# Altium schematic sheet RPI 3.SchDoc
size A4; SheetNumber: 1; SheetTotal: 1
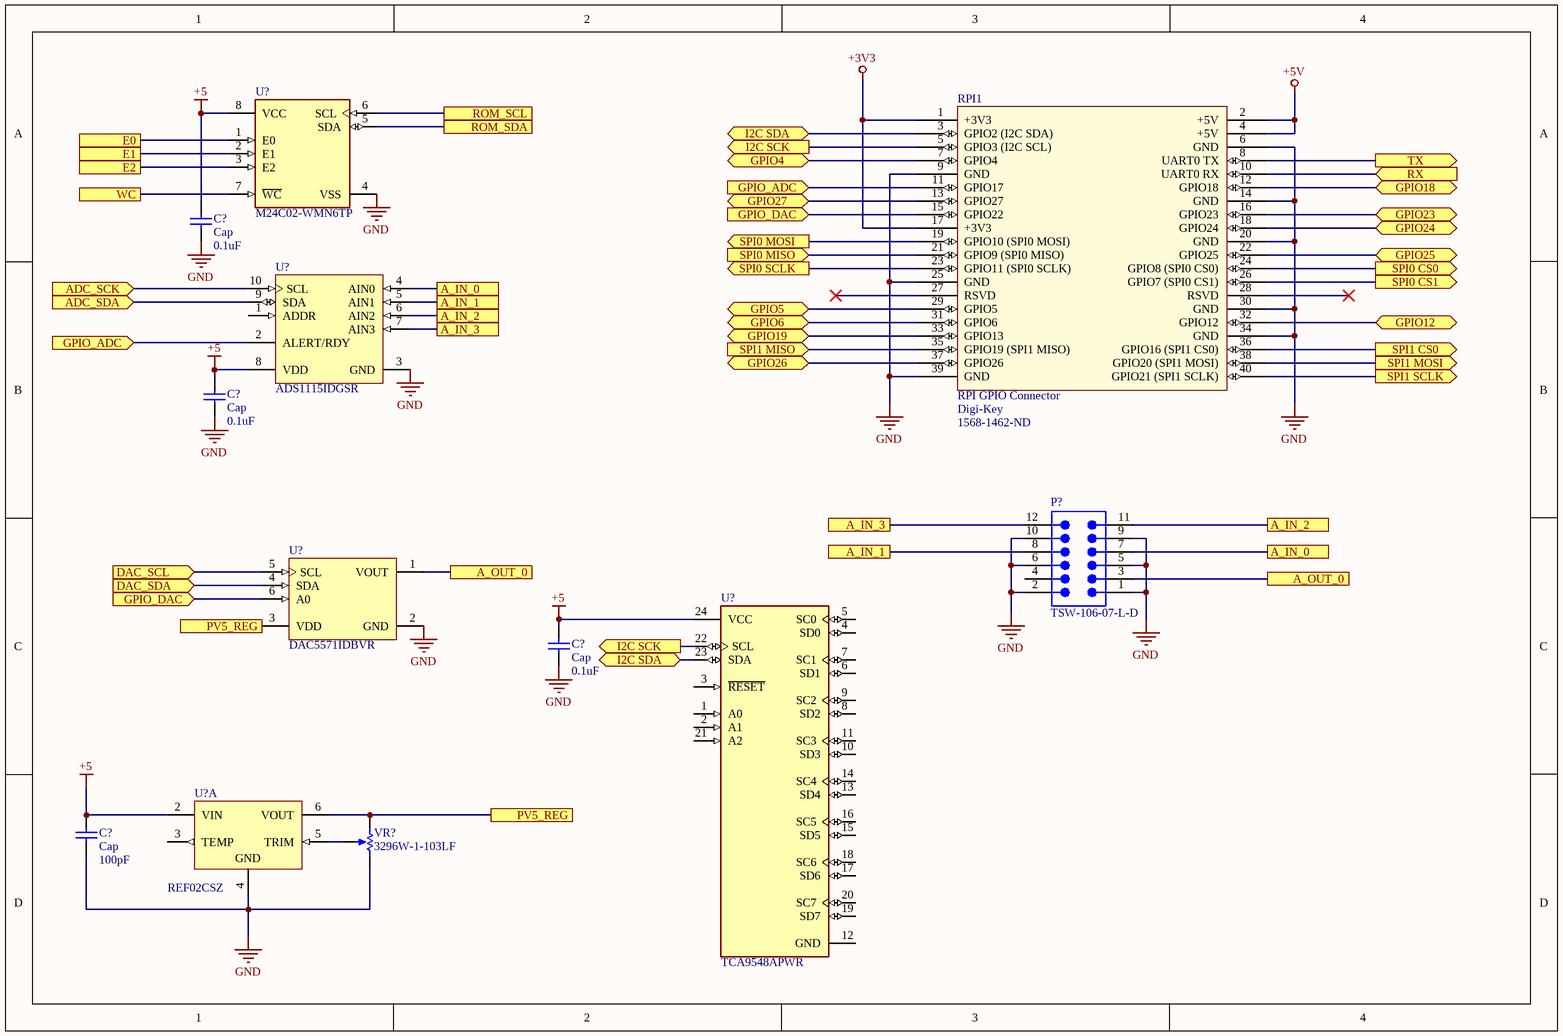
[diagram p0: RPI 3.SchDoc]

## Parts
(Parts that share a designator on the sheet are numbered #1, #2 ... from top to bottom, then left to right.)
C?#1  Cap  value 0.1uF  [RAD-0.3]
C?#2  Cap  value 0.1uF  [RAD-0.3]
C?#3  Cap  value 0.1uF  [RAD-0.3]
C?#4  Cap  value 100pF  [RAD-0.3]
P?  TSW-106-07-L-D  [SMTC-TSW-106-07-X-D]
RPI1  RPI GPIO Connector  Supplier 1: Digi-Key  Supplier Part Number 1: 1568-1462-ND  [rpi]
U?#1  M24C02-WMN6TP  [FP-SO8N-SO-A-MFG]
U?#2  ADS1115IDGSR  [TI-DGS10_N]
U?#3  DAC5571IDBVR  [TI-DBV6_N]
U?#4  TCA9548APWR  [FP-PW0024A-MFG]
U?#5  REF02CSZ  [ADI-R-8_N]  (part A of 2)
VR?  3296W-1-103LF  [BOUR-3296W]

## Ports
A_IN_0, A_IN_1, A_IN_2, A_IN_3, A_OUT_0, ADC_SCK (in), ADC_SDA (in), DAC_SCL (in), DAC_SDA (in), E0, E1, E2, GPIO4 (bidir), GPIO5 (bidir), GPIO6 (bidir), GPIO12 (bidir), GPIO18 (bidir), GPIO19 (bidir), GPIO23 (bidir), GPIO24 (bidir), GPIO25 (bidir), GPIO26 (bidir), GPIO27 (bidir), GPIO_ADC (in), GPIO_DAC (in), I2C SCK (out), I2C SDA (bidir), PV5_REG, ROM_SCL, ROM_SDA, RX (in), SPI0 CS0 (out), SPI0 CS1 (out), SPI0 MISO (in), SPI0 MOSI (out), SPI0 SCLK (out), SPI1 CS0 (out), SPI1 MISO (in), SPI1 MOSI (out), SPI1 SCLK (out), TX (out), WC

## Nets
+3V3: RPI1.1(+3V3) RPI1.17(+3V3)
+5: C?#1.2 C?#2.2 C?#3.2 C?#4.2 U?#1.8(VCC) U?#2.8(VDD) U?#4.24(VCC) U?#5.2(VIN)
+5V: RPI1.2(+5V) RPI1.4(+5V)
GND: C?#1.1 C?#2.1 C?#3.1 C?#4.1 P?.1 P?.2 P?.5 P?.6 P?.9 P?.10 RPI1.6(GND) RPI1.9(GND) RPI1.14(GND) RPI1.20(GND) RPI1.25(GND) RPI1.30(GND) RPI1.34(GND) RPI1.39(GND) U?#1.4(VSS) U?#2.3(GND) U?#3.2(GND) U?#5.4(GND) VR?.3(CW)
A_IN_0: P?.7 U?#2.4(AIN0) ; port A_IN_0
A_IN_1: P?.8 U?#2.5(AIN1) ; port A_IN_1
A_IN_2: P?.11 U?#2.6(AIN2) ; port A_IN_2
A_IN_3: P?.12 U?#2.7(AIN3) ; port A_IN_3
A_OUT_0: P?.3 U?#3.1(VOUT) ; port A_OUT_0
ADC_SCK: U?#2.10(SCL) ; port ADC_SCK
ADC_SDA: U?#2.9(SDA) ; port ADC_SDA
DAC_SCL: U?#3.5(SCL) ; port DAC_SCL
DAC_SDA: U?#3.4(SDA) ; port DAC_SDA
E0: U?#1.1(E0) ; port E0
E1: U?#1.2(E1) ; port E1
E2: U?#1.3(E2) ; port E2
GPIO4: RPI1.7(GPIO4) ; port GPIO4
GPIO5: RPI1.29(GPIO5) ; port GPIO5
GPIO6: RPI1.31(GPIO6) ; port GPIO6
GPIO12: RPI1.32(GPIO12) ; port GPIO12
GPIO18: RPI1.12(GPIO18) ; port GPIO18
GPIO19: RPI1.33(GPIO13) ; port GPIO19
GPIO23: RPI1.16(GPIO23) ; port GPIO23
GPIO24: RPI1.18(GPIO24) ; port GPIO24
GPIO25: RPI1.22(GPIO25) ; port GPIO25
GPIO26: RPI1.37(GPIO26) ; port GPIO26
GPIO27: RPI1.13(GPIO27) ; port GPIO27
GPIO_ADC: RPI1.11(GPIO17) U?#2.2(ALERT/RDY) ; port GPIO_ADC
GPIO_DAC: RPI1.15(GPIO22) U?#3.6(A0) ; port GPIO_DAC
I2C SCK: RPI1.5(GPIO3_(I2C_SCL)) U?#4.22(SCL) ; port I2C SCK
I2C SDA: RPI1.3(GPIO2_(I2C_SDA)) U?#4.23(SDA) ; port I2C SDA
PV5_REG: U?#3.3(VDD) U?#5.6(VOUT) VR?.1(CCW) ; port PV5_REG
ROM_SCL: U?#1.6(SCL) ; port ROM_SCL
ROM_SDA: U?#1.5(SDA) ; port ROM_SDA
RX: RPI1.10(UART0_RX) ; port RX
SPI0 CS0: RPI1.24(GPIO8_(SPI0_CS0)) ; port SPI0 CS0
SPI0 CS1: RPI1.26(GPIO7_(SPI0_CS1)) ; port SPI0 CS1
SPI0 MISO: RPI1.21(GPIO9_(SPI0_MISO)) ; port SPI0 MISO
SPI0 MOSI: RPI1.19(GPIO10_(SPI0_MOSI)) ; port SPI0 MOSI
SPI0 SCLK: RPI1.23(GPIO11_(SPI0_SCLK)) ; port SPI0 SCLK
SPI1 CS0: RPI1.36(GPIO16_(SPI1_CS0)) ; port SPI1 CS0
SPI1 MISO: RPI1.35(GPIO19_(SPI1_MISO)) ; port SPI1 MISO
SPI1 MOSI: RPI1.38(GPIO20_(SPI1_MOSI)) ; port SPI1 MOSI
SPI1 SCLK: RPI1.40(GPIO21_(SPI1_SCLK)) ; port SPI1 SCLK
TX: RPI1.8(UART0_TX) ; port TX
WC: U?#1.7(~{WC}) ; port WC
NetU?#5_5: U?#5.5(TRIM) VR?.2(S)

Not connected (* = marked no-connect by the designer): P? 4; RPI1 27(RSVD)* 28(RSVD)*; U?#2 1(ADDR); U?#4 1(A0) 2(A1) 3(~{RESET}) 4(SD0) 5(SC0) 6(SD1) 7(SC1) 8(SD2) 9(SC2) 10(SD3) 11(SC3) 12(GND) 13(SD4) 14(SC4) 15(SD5) 16(SC5) 17(SD6) 18(SC6) 19(SD7) 20(SC7) 21(A2); U?#5 3(TEMP)

## Library data of the parts
C?#1-C?#4 = Cap: Capacitor; Published: 8-Jun-2000; LatestRevisionDate: 17-Jul-2002; LatestRevisionNote: Re-released for DXP Platform.; PackageReference: RAD-0.3; Publisher: Altium Limited; PackageDescription: Radial Cap, Thru-Hole; 2 Leads; 0.3 in Pin Spacing
P? = CMP-1024-00382-1: 0.025" SQ Post Header, Through-hole, Vertical, -55 to 125 degC, 2.54 mm Pitch, 12-Pin, Male, RoHS; Manufacturer: Samtec; Pitch: 2.54 mm; ComponentLink2Description: Datasheet; ComponentLink1URL: http://www.samtec.com; DatasheetVersion: F-214; RoHS: True; ComponentLink3URL: http://www.samtec.com/documents/webfiles/cpdf/TSW-XXX-XX-XXX-X-XX-XXX-MKT.pdf; ComponentLink1Description: Manufacturer URL; PackageVersion: DM, 8/1988; Mounting Technology: Through-hole; PartNumber: TSW-106-07-L-D; Temperature Range: -55 to 125 degC; ComponentLink3Description: Package Specification; Orientation: Vertical; PackageDescription: .025[0.64] SQ. Post Terminal Strip Assembly; PackageReference: TSW-106-07-X-D; ComponentLink2URL: http://www.samtec.com/documents/webfiles/pdf/TSW_TH.PDF
RPI1 = rpi connector: GPIO Header for Raspberry Pi A+/B+/Pi 2/Pi 3 - 2x20; Manufacturer: SparkFun Electronics; Manufacturer Part Number: PRT-14017; Nils Minor: author; nilsminor@web.de: mail; RoHS: RoHS Compliant; Category: Development Boards, Kits, Programmers; Stock 1: 150; Pricing 1: 1=1.84 (EUR); Part Status: Active; Accessory Type: Connector; For Use With/Related Products: Raspberry Pi; ComponentLink1URL: https://cdn.sparkfun.com/datasheets/Dev/RaspberryPi/12313.pdf; ComponentLink1Description: https://cdn.sparkfun.com/datasheets/Dev/RaspberryPi/12313.pdf
U?#1 = CMP-2000-05370-2: IC EEPROM 2K I2C 400KHZ 8SO; Manufacturer: STMicroelectronics; Min Supply Voltage: 2.5V; Standoff Height: 0.1mm; Nominal Supply Current: 0.5-1mA; Description: EEPROM Memory IC 2Kb (256 x 8) I²C 400kHz 900ns 8-SO; Access Time: 900ns; Memory Size: 2Kbits; Max Supply Voltage: 5.5V; Digikey Description: IC EEPROM 2K I2C 400KHZ 8SO; Memory Type: EEPROM; ComponentLink2URL: https://www.st.com/resource/en/datasheet/m24c02-w.pdf; Device Class L3: EEPROM; Interface: I2C; Temperature Range High: +85°C; Mouser Description: M24C02 Series 2 Kb (256 x 8) 2.5 V SMT Serial I²C Bus EEPROM - SOIC-8; RoHS: TRUE; Lead Free: Yes; Ambient Temperature Range Low: -40°C; Temperature: -40°C to +85°C; Device Class L1: Integrated Circuits (ICs); Temperature Range Low: -40°C; Frequency: 400kHz; Category: IC; Manufacturer Part Number: M24C02-WMN6TP; Height: 1.75mm; Octopart: https://octopart.com/m24c02-wmn6tp-stmicroelectronics-55404516; Automotive: No; Ambient Temperature Range High: +85°C; ComponentLink2Description: Datasheet; Package: SO8N-SO-A; Device Class L2: Memory
U?#2 = CMP-0003-00385-2: 16-Bit ADC with Integrated Multiplexer, PGA, Comparator, Oscillator, and Reference, -40 to 125 degC, 10-pin SOP (DGS10), Green (RoHS & no Sb/Br); Manufacturer: Texas Instruments; Digital Supply(Min)(V): 2; # Input Channels: 4; Resolution(Bits): 16; SubFamily: Precision ADC (<=10MSPS); Sample Rate (max)(SPS): 860; Analog Voltage AV/DD(Max)(V): 5.5; INL(Max)(+/-LSB): 1; Interface: Serial I2C; Architecture: Delta-Sigma; PackageVersion: 4073272/C, 02/2004; Mounting Technology: Surface Mount; ComponentLink1URL: http://www.ti.com/; Eco-Plan: Green (RoHS & no Sb/Br); Analog Voltage AV/DD(Min)(V): 2; ComponentLink3URL: http://www.ti.com/lit/ml/mpds035b/mpds035b.pdf; PartNumber: ADS1115IDGSR; ComponentLink3Description: Package Specification; DatasheetVersion: SBAS444B; ComponentLink1Description: Manufacturer URL; Code_JEDEC: MO-153; Digital Supply(Max)(V): 5.5; ComponentLink2Description: Datasheet; ComponentLink2URL: http://www.ti.com/general/docs/lit/getliterature.tsp?genericPartNumber=ADS1115&fileType=pdf; PackageDescription: 10-Pin Plastic Small Outline, Body 3 x 3 mm, Pitch 0.5 mm; PackageReference: DGS10
U?#3 = CMP-0004-00328-1: Low-Power, 8-Bit DAC with High-Speed I2C Input, -40 to 105 degC, 6-pin SOT23 (DBV6), Green (RoHS & no Sb/Br); Manufacturer: Texas Instruments; Resolution(Bits): 8; DNL(Max)(+/-LSB): 0.25; INL(Max)(+/-LSB): 1; Power Consumption(Typ)(mW): 0.4; SubFamily: Precision DAC (=<10MSPS); Interface: Serial I2C; PackageVersion: 4073253-5/K, 03/2006; ComponentLink2URL: http://www.ti.com/general/docs/lit/getliterature.tsp?genericPartNumber=DAC5571&fileType=pdf; DatasheetVersion: SLAS405A; Mounting Technology: Surface Mount; Settling Time(us): 8; PartNumber: DAC5571IDBVR; ComponentLink1Description: Manufacturer URL; PackageReference: DBV6; PackageDescription: 6-Pin Plastic Small Outline, Body 1.6 x 2.9 mm, Pitch 0.95 mm; ComponentLink2Description: Datasheet; ComponentLink3Description: Package Specification; Eco-Plan: Green (RoHS & no Sb/Br); DAC Channels: 1; ComponentLink1URL: http://www.ti.com/; ComponentLink3URL: http://www.ti.com/litv/pdf/mpds026h; Code_JEDEC: MO-178
U?#4 = CMP-04892-000002-1: IC I2C SW 8CH W/RESET 24TSSOP; Manufacturer: Texas Instruments; Number Of Circuits: 1; Mux Demux Ratio: 1:8; Nominal Supply Current: 2-50uA; Interface: I2C,SMBus; Min Supply Voltage: 1.65V; Standoff Height: 0.05mm; Description: Bus Switch 1 x 8:1 24-TSSOP; Max Supply Voltage: 5.5V; Device Class L2: Interface ICs; ComponentLink2Description: Datasheet; Ipc Land Pattern Name: SOP65P640X120-24; Category: IC; Device Class L1: Integrated Circuits (ICs); Manufacturer Part Number: TCA9548APWR; RoHS: TRUE; Temperature Range High: +85°C; Digikey Description: IC I2C SW 8CH W/RESET 24TSSOP; Temperature Range Low: -40°C; Lead Free: Yes; Package: PW0024A; ComponentLink2URL: http://www.ti.com/lit/ds/symlink/tca9548a.pdf; Device Class L3: Multiplexers; Ambient Temperature Range Low: -40°C; Mouser Description: Low-Voltage 8-Channel I2C Switch With Reset 24-TSSOP -40 to 85; Temperature: -40°C to +85°C; Octopart: https://octopart.com/tca9548apwr-texas+instruments-22266789; Ambient Temperature Range High: +85°C; Automotive: No; Height: 1.2mm
U?#5 = CMP-0784-00213-1: Precision Voltage Reference, 5 V Output, 7 to 36 V Supply, Industrial, 8-pin SOIC (R-8), Tube; Manufacturer: Analog Devices; Min V Supply (V): 7; Max V Supply (V): 36; Vout: 5V; Ref Out TC (ppm/C): 20; Operating Temp Range: -40 to 85 degC; PackageVersion: 060506-A, 06/2006; Code_JEDEC: MS-012-AA; ComponentLink4Description: URL Link1; ComponentLink3Description: Package Specification; PackageDescription: 8-Pin Standard Small Outline Package, Body 4.9 x 3.9 mm, Pitch 1.27 mm; DatasheetVersion: Rev. K; ComponentLink1Description: Manufacturer URL; Mounting Technology: Surface Mount; ComponentLink1URL: http://www.analog.com/en/index.html; ComponentLink4URL: Product URL:http://www.analog.com/en/special-linear-functions/voltage-references/ref02/products/product.html; PackageReference: R-8; ComponentLink2Description: Datasheet; ComponentLink3URL: http://www.analog.com/static/imported-files/packages/PKG_PDF/SOIC_Narrow%20(R)/R_8.pdf; ComponentLink2URL: http://www.analog.com/static/imported-files/data_sheets/REF01_02_03.pdf; Packing: Tube; PartNumber: REF02CSZ
VR? = CMP-1747-00001-1: Square Trimpot(R) Trimming Potentiometer, 10 KOhm, +/- 10%, 0.5 W, -55 to 125 degC, 3-Pin THD, RoHS, Tube; Voltage Rating: 75 V; Resistance: 120 Ohm; Tolerance: 1%; Power Rating: 100 mW; Case\Package: 0603; Type (Resistor): Thick Film; PackageDescription: 3-Pin Through Hole Device, Body 9.53 x 4.83 mm, Pitch 2.54 mm; RoHSCompliant: true; Package Quantity: 5000; Case Code (Metric): 1608; PackageReference: 3296W; ComponentLink2Description: Datasheet; REACH SVHC: Unknown; Case Code (Imperial): 0603; ComponentLink1URL: http://www.bourns.com/; Width: 0.85 mm; Radiation Hardening: No; Min Operating Temperature: -55 degC; Mount: Surface Mount; ComponentLink1Description: Manufacturer URL; Max Operating Temperature: 155 degC; Weight: 7.1E-05 oz; Pins: 2; DatasheetVersion: May-16; Packaging: Tape and Reel; Height: 0.45 mm; Length: 1.55 mm; ComponentLink2URL: http://www.bourns.com/docs/Product-Datasheets/3296.pdf